# EAGLE design gatedelay 11-30-19 (EAGLE 9.5.1)
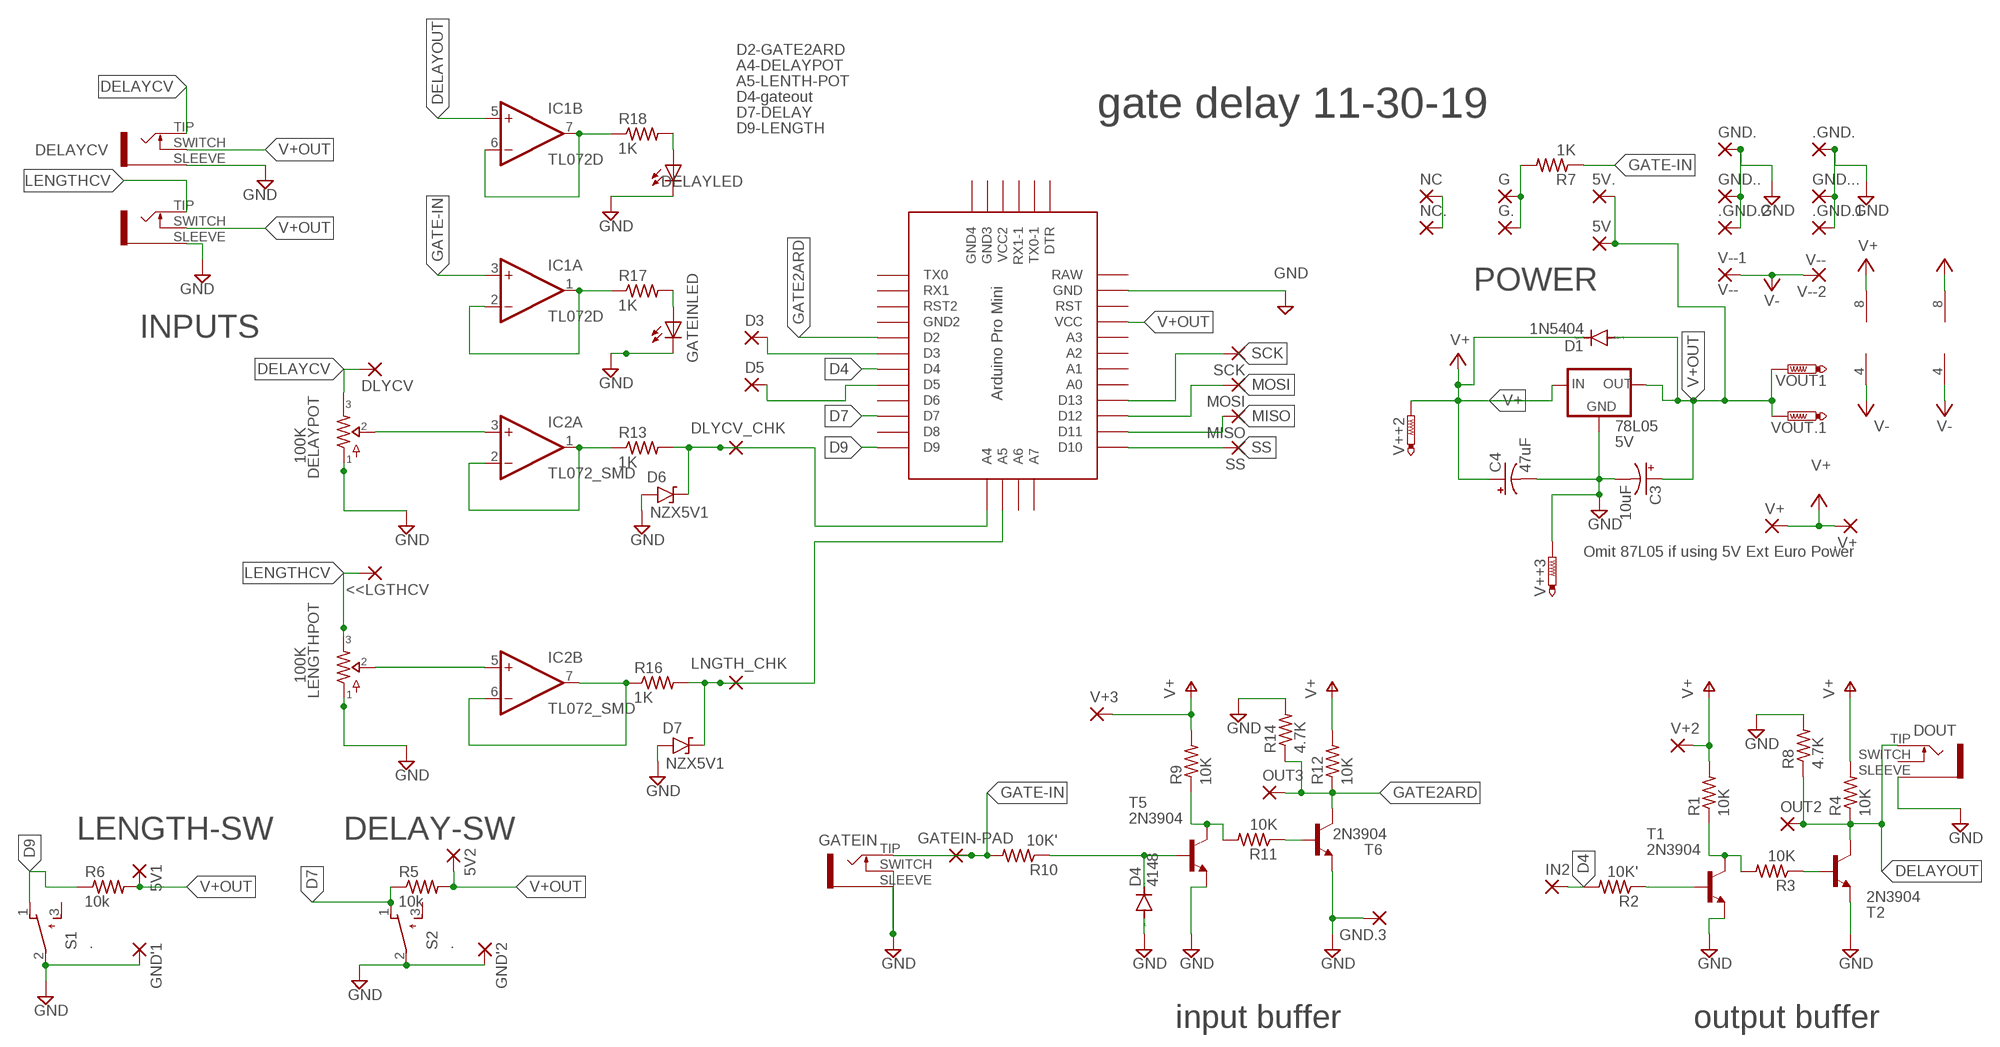
[diagram p0: schematic, sheet 1]

## Parts
5V  1,6/0,8  [1,6/0,8]
5V1  WIREPAD2,54/0,9  [2,54/0,9]
5V2  WIREPAD2,54/0,9  [2,54/0,9]
5V.  1,6/0,8  [1,6/0,8]
78L05  5V  78LXX  [78LXX]
.GND.  1,6/0,8  [1,6/0,8]
.GND.1  1,6/0,8  [1,6/0,8]
.GND.2  1,6/0,8  [1,6/0,8]
.V+  1,6/0,8  [1,6/0,8]
<<LGTHCV  3,17/1,3  [3,17/1,3]
C3  10uF  CPOL-USE2.5-6  [E2,5-6]
C4  47uF  CPOL-USE2.5-7  [E2,5-7]
D1  1N5404  1N4148DO35-10  [DO35-10]
D3  WIREPAD2,15/1,0  [2,15/1,0]
D4  4148  1N4148DO35-7  [DO35-7]
D5  WIREPAD2,15/1,0  [2,15/1,0]
D6  NZX5V1  ZENER.2  [DO41-2]
D7  NZX5V1  ZENER.2  [DO41-2]
DELAYCV  35RAPC2AV  [35RAPCVAV]
DELAYLED  LED3MM  [LED3MM]
DELAYPOT  100K  POTS9MM_VERT  [9MM_VERT]
DLYCV  WIREPAD1,6/0,9  [1,6/0,9]
DLYCV_CHK  3,17/1,3  [3,17/1,3]
DOUT  35RAPC2AV  [35RAPCVAV]
G  1,6/0,8  [1,6/0,8]
G.  1,6/0,8  [1,6/0,8]
GATEIN  35RAPC2AV  [35RAPCVAV]
GATEIN-PAD  WIREPAD1,6/0,9  [1,6/0,9]
GATEINLED  LED3MM  [LED3MM]
GND'1  WIREPAD2,54/0,9  [2,54/0,9]
GND'2  WIREPAD2,54/0,9  [2,54/0,9]
GND.  1,6/0,8  [1,6/0,8]
GND.3  WIREPAD1,6/0,9  [1,6/0,9]
GND..  1,6/0,8  [1,6/0,8]
GND...  1,6/0,8  [1,6/0,8]
IC1  TL072D  [SO08]
IC2  TL072_SMD  [SO08]
IN2  WIREPAD1,6/0,9  [1,6/0,9]
LENGTHCV  35RAPC2AV  [35RAPCVAV]
LENGTHPOT  100K  POTS9MM_VERT  [9MM_VERT]
LNGTH_CHK  3,17/1,3  [3,17/1,3]
MISO  WIREPAD1,6/0,9  [1,6/0,9]
MOSI  WIREPAD1,6/0,9  [1,6/0,9]
NC  1,6/0,8  [1,6/0,8]
NC.  1,6/0,8  [1,6/0,8]
OUT2  WIREPAD1,6/0,9  [1,6/0,9]
OUT3  WIREPAD1,6/0,9  [1,6/0,9]
R1  10K  R-US_0204/5  [0204/5]
R2  10K'  R-US_0204/5  [0204/5]
R3  10K  R-US_0204/5  [0204/5]
R4  10K  R-US_0204/5  [0204/5]
R5  10k  R-US_0207/10  [0207/10]
R6  10k  R-US_0204/5  [0204/5]
R7  1K  R-US_0207/7  [0207/7]
R8  4.7K  R-US_0204/5  [0204/5]
R9  10K  R-US_0204/5  [0204/5]
R10  10K'  R-US_0204/5  [0204/5]
R11  10K  R-US_0204/5  [0204/5]
R12  10K  R-US_0204/5  [0204/5]
R13  1K  R-US_0204/7  [0204/7]
R14  4.7K  R-US_0204/5  [0204/5]
R16  1K  R-US_0204/7  [0204/7]
R17  1K  R-US_0204/7  [0204/7]
R18  1K  R-US_0207/15  [0207/15]
S1  .  ALCOSWTT11  [ALCOSWTT11]
S2  .  ALCOSWTT11  [ALCOSWTT11]
SCK  WIREPAD1,6/0,9  [1,6/0,9]
SS  WIREPAD1,6/0,9  [1,6/0,9]
T1  2N3904  [TO92]
T2  2N3904  [TO92]
T5  2N3904  [TO92]
T6  2N3904  [TO92]
U$1  PRO-MINI  [PRO-MINI]
V+  1,6/0,8  [1,6/0,8]
V+2  WIREPAD1,6/0,9  [1,6/0,9]
V+3  WIREPAD1,6/0,9  [1,6/0,9]
V++2  PTR1PAD1-13Y  [P1-13Y]
V++3  PTR1PAD1-13Y  [P1-13Y]
V--1  V--  1,6/0,8  [1,6/0,8]
V--2  V--  1,6/0,8  [1,6/0,8]
VOUT1  PTR1PAD1-13Y  [P1-13Y]
VOUT.1  PTR1PAD1-13Y  [P1-13Y]

## Nets
D4: IN2.1(P) R2.2 U$1.D4
D7: R5.1 S2.1(O) U$1.D7
D9: R6.1 S1.1(O) U$1.D9
DELAYCV: DELAYCV.TIP DELAYPOT.3 DLYCV.1(P)
DELAYOUT: DOUT.TIP IC1.5(B:+IN) OUT2.1(P) R4.1 R8.1 T2.1(C)
GATE2ARD: OUT3.1(P) R12.1 R14.1 T6.1(C) U$1.D2
GATE-IN: GATEIN-PAD.1(P) GATEIN.TIP IC1.3(A:+IN) R7.1 R10.2
GND: 78L05.GND .GND.1.1(P) .GND.2.1(P) .GND..1(P) C3.- C4.- D4.A D6.A D7.A DELAYCV.SLEEVE DELAYLED.K(C) DELAYPOT.1 DOUT.SLEEVE GATEIN.SLEEVE GATEIN.SWITCH GATEINLED.K(C) GND'1.1(P) GND'2.1(P) GND.3.1(P) GND..1(P) GND...1(P) GND....1(P) LENGTHCV.SLEEVE LENGTHPOT.1 R8.2 R14.2 S1.2(P) S2.2(P) T1.3(E) T2.3(E) T5.3(E) T6.3(E) U$1.GND V++3.TP
LENGTHCV: <<LGTHCV.1(P) LENGTHCV.TIP LENGTHPOT.3
MISO: MISO.1(P) U$1.D11
MOSI: MOSI.1(P) U$1.D12
N$1: D5.1(P) U$1.D5
N$2: R2.1 T1.2(B)
N$3: R1.1 R3.2 T1.1(C)
N$4: R3.1 T2.2(B)
N$5: G.1(P) G..1(P) R7.2
N$6: D3.1(P) U$1.D3
N$7: NC.1(P) NC..1(P)
N$12: D4.C R10.1 T5.2(B)
N$13: R9.1 R11.2 T5.1(C)
N$14: R11.1 T6.2(B)
N$16: D6.C DLYCV_CHK.1(P) R13.2 U$1.A4
N$17: DELAYPOT.2 IC2.3(A:+IN)
N$18: IC2.1(A:OUT) IC2.2(A:-IN) R13.1
N$20: IC2.5(B:+IN) LENGTHPOT.2
N$21: IC2.6(B:-IN) IC2.7(B:OUT) R16.1
N$23: D7.C LNGTH_CHK.1(P) R16.2 U$1.A5
N$24: GATEINLED.A R17.2
N$26: IC1.1(A:OUT) IC1.2(A:-IN) R17.1
N$27: IC1.6(B:-IN) IC1.7(B:OUT) R18.1
N$29: DELAYLED.A R18.2
SCK: SCK.1(P) U$1.D13
SS: SS.1(P) U$1.D10
V+: 78L05.IN .V+.1(P) C4.+ D1.C IC1.8(P:V+) IC2.8(P:V+) R1.2 R4.2 R9.2 R12.2 V+2.1(P) V+3.1(P) V++2.TP V+.1(P)
V+OUT: 5V1.1(P) 5V2.1(P) 5V.1(P) 5V..1(P) 78L05.OUT C3.+ D1.A DELAYCV.SWITCH LENGTHCV.SWITCH R5.2 R6.2 U$1.VCC VOUT1.TP VOUT.1.TP
V-: IC1.4(P:V-) IC2.4(P:V-) V--1.1(P) V--2.1(P)
Unconnected: DOUT.SWITCH S1.3(S) S2.3(S) U$1.A0 U$1.A1 U$1.A2 U$1.A3 U$1.A6 U$1.A7 U$1.D6 U$1.D8 U$1.DTR U$1.GND1(GND2) U$1.GND2(GND4) U$1.GND3 U$1.RST U$1.RST1(RST2) U$1.RX1 U$1.RX1-1 U$1.TX0 U$1.TX0-1 U$1.VCC1(VCC2)

## Notes on the sheet
- D2-GATE2ARD
- A4-DELAYPOT
- A5-LENTH-POT
- D4-gateout
- D7-DELAY | gate delay 11-30-19
- D9-LENGTH
- POWER
- INPUTS
- Omit 87L05 if using 5V Ext Euro Power
- LENGTH-SW | DELAY-SW
- input buffer | output buffer

## Power pins joined to a net without a drawn wire
RAW: U$1.RAW

## Library data of the parts
5V 5V. .GND. .GND.1 .GND.2 .V+ G G. GND. GND.. GND... NC NC. V+ V--1 V--2 = wirepad-NONAMES:1,6/0,8: THROUGH-HOLE PAD
5V1 5V2 D3 D5 GND'1 GND'2 = wirepad:WIREPAD: Wire PAD connect wire on PCB
78L05 = v-reg:78LXX: VOLTAGE REGULATOR
<<LGTHCV DLYCV_CHK LNGTH_CHK = wirepad:3,17/1,3: THROUGH-HOLE PAD
C3 C4 = adafruit:CPOL-US: POLARIZED CAPACITOR, American symbol
D1 D4 = diode:1N4148: DIODE high speed (Philips)
D6 D7 = diodes:ZENER
DELAYCV DOUT GATEIN LENGTHCV = MusicThingModular-CL:35RAPC2AV: Switchcraft 35RAPC2AV jack
DELAYLED GATEINLED = adafruit:LED: LED OSRAM: - CHIPLED LG R971, LG N971, LY N971, LG Q971, LY Q971, LO R971, LY R971 LH N974, LH R974 LS Q976, LO Q976, LY Q976 LO Q996 - Hyper CHIPLED LW Q18S LB Q993, LB Q99A, LB R99A - SideLED LS A670, LO A670, LY A670, LG A670, LP A670 LB A673, LV A673, LT A673, LW A673 LH A674 LY A675 LS A676, LA A676, LO A676, LY A676, LW A676 LS A679, LY A679, LG A679 - Hyper Micro SIDELED® LS Y876, LA Y876, LO Y876, LY Y876 LT Y87S - SmartLED LW L88C, LW L88S LB L89C, LB L89S, LG L890 LS L89K, LO L89K, LY L89K LS L896, LA L896, LO L896, LY L896 - TOPLED LS T670, LO T670, LY T670, LG T670, LP T670 LSG T670, LSP T670, LSY T670, LOP T670, LYG T670 LG T671, LOG T671, LSG T671 LB T673, LV T673, LT T673, LW T673 LH T674 LS T676, LA T676, LO T676, LY T676, LB T676, LH T676, LSB T676, LW T676 LB T67C, LV T67C, LT T67C, LS T67K, LO T67K, LY T67K, LW E67C LS E67B, LA E67B, LO E67B, LY E67B, LB E67C, LV E67C, LT E67C LW T67C LS T679, LY T679, LG T679 LS T770, LO T770, LY T770, LG T770, LP T770 LB T773, LV T773, LT T773, LW T773 LH T774 LS E675, LA E675, LY E675, LS T675 LS T776, LA T776, LO T776, LY T776, LB T776 LHGB T686 LT T68C, LB T68C - Hyper Mini TOPLED® LB M676 - Mini TOPLED Santana® LG M470 LS M47K, LO M47K, LY M47K Source: http://www.osram.convergy.de/
DELAYPOT LENGTHPOT = potentiometers:POTS
DLYCV GATEIN-PAD GND.3 IN2 MISO MOSI OUT2 OUT3 SCK SS V+2 V+3 = wirepad-NONAMES:WIREPAD: Wire PAD connect wire on PCB
IC1 = linear:TL072: OP AMP
IC2 = MusicThingModular:TL072: Generic Dual Op Amp
R1-R4 R8-R12 R14 R18 = rcl:R-US_: RESISTOR, American symbol; SPICEPREFIX: R
R5-R7 R17 = adafruit:R-US_: RESISTOR, American symbol
R13 R16 = rcl:R-US_: RESISTOR, American symbol
S1 S2 = switch-CL:ALCOSWTT11: TINY SWITCH ON - MOM Source: http://www2.produktinfo.conrad.com/datenblaetter/700000-724999/705152-da-01-de-Subminiaturschalter_TL_36YO.pdf
T1 T2 T5 T6 = transistor:2N3904: NPN TRANSISTOR
U$1 = Arduino-clone:PRO-MINI: Arduion Pro Mini Clone V1.0 www.betemcu.cu
V++2 V++3 VOUT1 VOUT.1 = testpad-CL:PTR1: TEST PIN

## Board
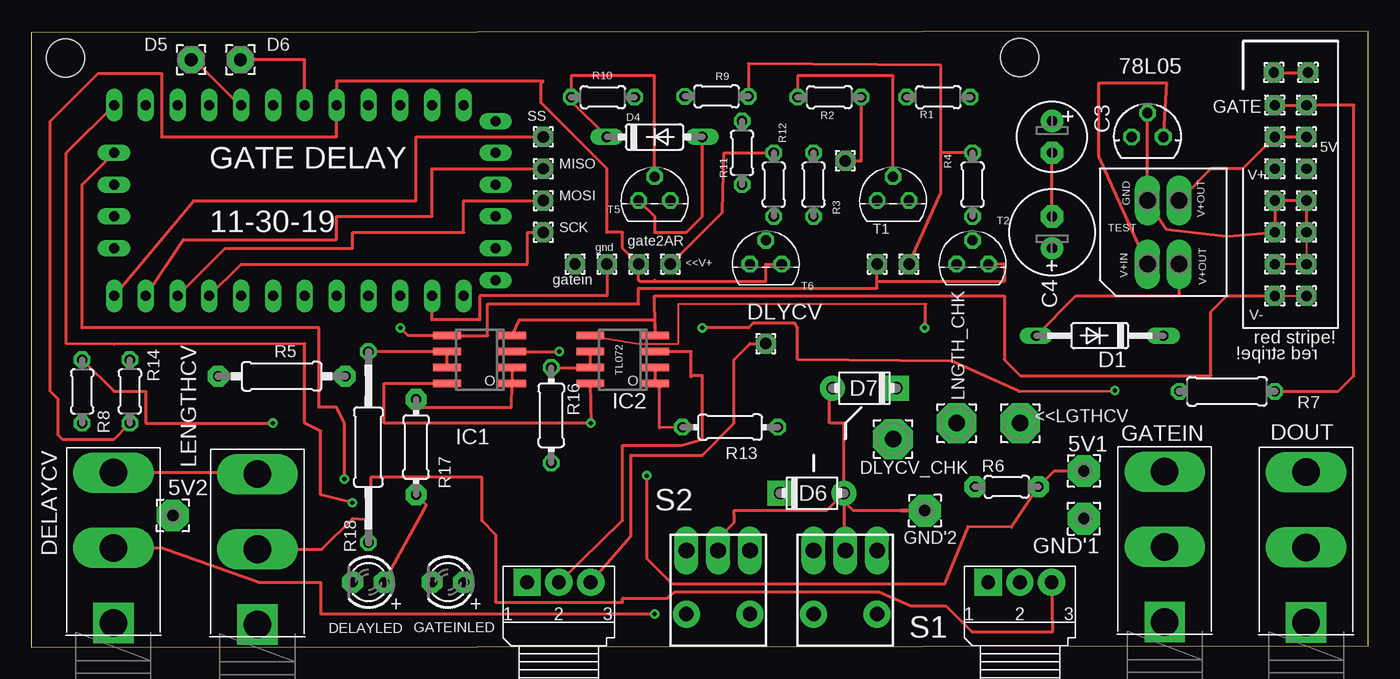
[diagram p1: board, top side]
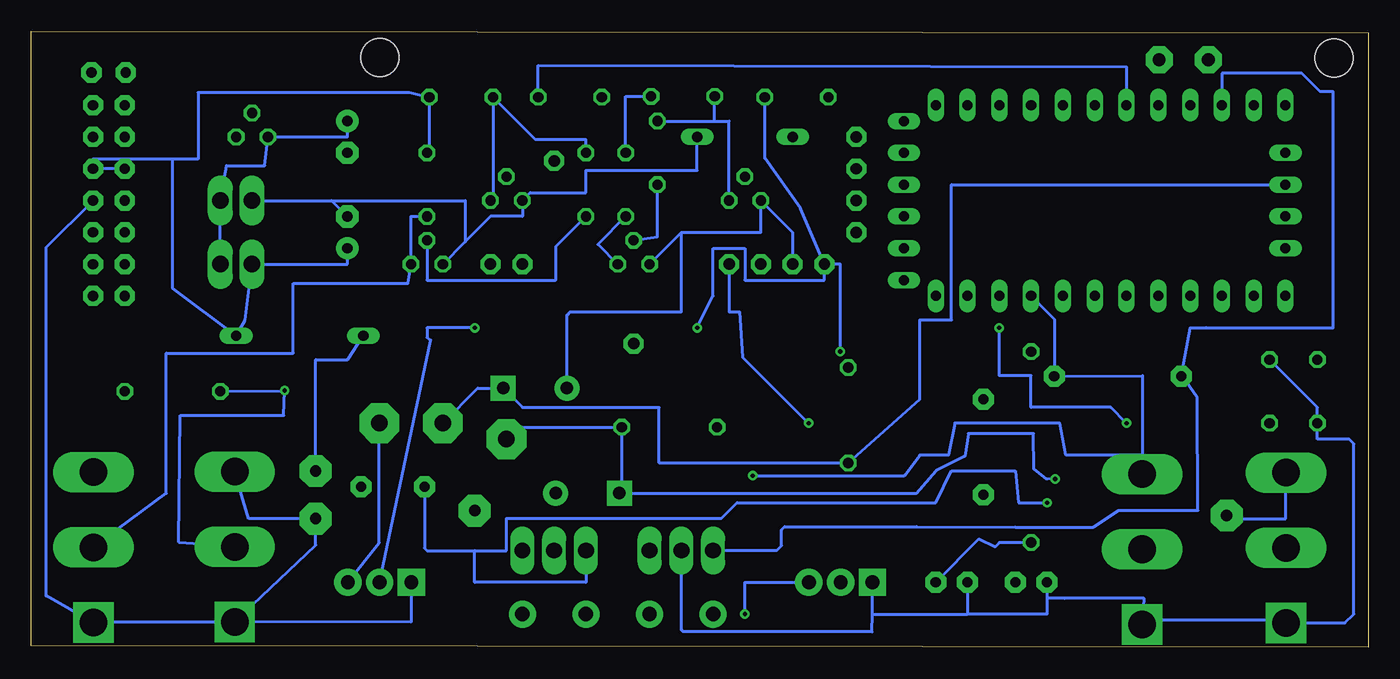
[diagram p2: board, bottom side, seen from below]

Size 106.79 x 49.2 mm. Coordinates in mm from the lower left corner, seen from the top.
Outline: 0,0 106.79,0.13 106.79,49.2 0,49.07 0,0
Copper layers (1*16): Top 0.035mm / dielectric 1.5mm / Bottom 0.035mm
Design rules "default": minimum track width 6mil, minimum drill 0.35mm, track to track 6mil, track to pad 6mil, pad to pad 6mil, via to via 6mil, smd to smd 6mil, copper to edge 40mil, drill to drill 6mil, minimum pad ring 10mil, minimum via ring 8mil, stop-mask expansion 4mil, vias tented up to drill 0mil, thermal gap 10mil
Holes 3.05 mm at 78.93,47.12 2.73,47.05

### Footprints (pad centres in the part's own frame; a part is rotated, then mirrored left to right if it is on the bottom)
1,6/0,8 = drill 0.813 pad 1.6 octagon: 1 0,0
2,54/0,9 = drill 0.914 pad 2.54 octagon: 1 0,0
78LXX = drill 0.813 octagon: GND 0,1.905; IN 1.27,0; OUT -1.27,0
3,17/1,3 = drill 1.321 pad 3.175 octagon: 1 0,0
E2,5-6 = drill 0.813 pad 1.778: + -1.27,0 | drill 0.813 pad 1.778 octagon: - 1.27,0
E2,5-7 = drill 0.813 pad 1.778: + -1.27,0 | drill 0.813 pad 1.778 octagon: - 1.27,0
DO35-10 = drill 0.813 long: A 5.08,0; C -5.08,0
2,15/1,0 = drill 1.016 pad 2.159 octagon: 1 0,0
DO35-7 = drill 0.813 long: A 3.81,0; C -3.81,0
DO41-2 = drill 1 pad 2: A 2.54,0 | drill 1 pad 2 square: C -2.54,0
35RAPCVAV = drill 2.2 pad 1.778 square: SLEEVE 0,-6 | drill 2.2 pad 2.184 long: SWITCH 0,6; TIP 0,0
LED3MM = drill 0.813 pad 1.676 octagon: A -1.27,0; K 1.27,0
9MM_VERT = drill 1.1 pad 2.184 square: 1 2.54,0 | drill 1.1 pad 2.184: 2 0,0; 3 -2.54,0
1,6/0,9 = drill 0.914 pad 1.6 octagon: 1 0,0
SO08 = smd 0.6 x 2.2: 1 -1.905,-2.6; 2 -0.635,-2.6; 3 0.635,-2.6; 4 1.905,-2.6; 5 1.905,2.6; 6 0.635,2.6; 7 -0.635,2.6; 8 -1.905,2.6
0204/5 = drill 0.813 octagon: 1 -2.54,0; 2 2.54,0
0207/10 = drill 0.813 pad 1.676 octagon: 1 -5.08,0; 2 5.08,0
0204/5' = drill 0.813 pad 1.676 octagon: 1 -2.54,0; 2 2.54,0
0207/7 = drill 0.813 octagon: 1 -3.81,0; 2 3.81,0
0204/7 = drill 0.813 octagon: 1 -3.81,0; 2 3.81,0
0204/7' = drill 0.813 pad 1.676 octagon: 1 -3.81,0; 2 3.81,0
0207/15 = drill 0.813 octagon: 1 -7.62,0; 2 7.62,0
ALCOSWTT11 = drill 1.27 pad 1.778 long: 1 -2.54,2.54; 2 0,2.54; 3 2.54,2.54 | drill 1.143 pad 2.159: 4 -2.54,-2.54; 5 2.54,-2.54
TO92 = drill 0.813 octagon: 1 1.27,0; 2 0,1.905; 3 -1.27,0
PRO-MINI = drill 0.8 long: A0 8.89,8.89; A1 8.89,11.43; A2 8.89,13.97; A3 8.89,16.51; A4 -2.54,-1.27; A5 0,-1.27; A6 2.54,-1.27; A7 5.08,-1.27; D2 -6.35,16.51; D3 -6.35,13.97; D4 -6.35,11.43; D5 -6.35,8.89; D6 -6.35,6.35; D7 -6.35,3.81; D8 -6.35,1.27; D9 -6.35,-1.27; D10 8.89,-1.27; D11 8.89,1.27; D12 8.89,3.81; D13 8.89,6.35; DTR 7.62,29.21; GND 8.89,24.13; GND1 -6.35,19.05; GND2 -5.08,29.21; GND3 -2.54,29.21; RAW 8.89,26.67; RST 8.89,21.59; RST1 -6.35,21.59; RX1 -6.35,24.13; RX1-1 2.54,29.21; TX0 -6.35,26.67; TX0-1 5.08,29.21; VCC 8.89,19.05; VCC1 0,29.21
P1-13Y = drill 1.321 pad 1.905 long: TP 0,0

### Placement (x,y rotation side)
5V  99.31,40.77 0 top
5V1  84.07,14.1 0 top
5V2  11.3,10.54 0 top
5V.  101.85,40.77 0 top
78L05  89.15,40.77 0 top
.GND.  101.85,35.69 0 top
.GND.1  101.85,30.61 0 top
.GND.2  99.31,30.61 0 top
.V+  99.31,38.23 0 top
<<LGTHCV  78.99,17.91 0 top
C3  81.53,40.77 270 top
C4  81.53,33.15 90 top
D1  85.34,24.89 180 top
D3  16.7,46.93 0 top
D4  49.78,40.77 0 top
D5  12.76,46.93 0 top
D6  62.36,12.32 0 top
D7  66.55,20.7 180 top
DELAYCV  6.55,7.96 0 top
DELAYLED  33.27,5.21 180 top
DELAYPOT  42.14,5.21 180 top
DLYCV  58.67,24.26 0 top
DLYCV_CHK  68.83,16.64 0 top
DOUT  101.83,7.99 0 top
G  101.85,43.31 0 top
G.  99.31,43.31 0 top
GATEIN  90.54,8.04 0 top
GATEIN-PAD  43.43,30.61 0 top
GATEINLED  26.92,5.21 180 top
GND'1  84.07,10.29 180 top
GND'2  71.37,10.92 0 top
GND.  99.31,35.69 0 top
GND.3  45.97,30.61 0 top
GND..  99.31,33.15 0 top
GND...  101.85,33.15 0 top
IC1  35.81,22.99 90 top
IC2  47.24,22.99 90 top
IN2  65.02,38.86 0 top
LENGTHCV  18.06,7.84 0 top
LENGTHPOT  78.97,5.21 180 top
LNGTH_CHK  73.91,17.91 0 top
MISO  40.89,38.23 0 top
MOSI  40.89,35.69 0 top
NC  101.98,45.91 0 top
NC.  99.25,45.91 0 top
OUT2  67.56,30.61 0 top
OUT3  48.51,30.61 0 top
R1  72.45,43.94 0 top
R2  63.75,43.94 0 top
R3  62.48,36.96 90 top
R4  75.18,36.96 90 top
R5  20,21.65 0 top
R6  10k  [0204/5']  77.91,12.83 0 top
R7  95.5,20.45 0 top
R8  4.06,20.45 270 top
R9  54.74,44.01 0 top
R10  45.66,43.94 0 top
R11  56.77,39.5 90 top
R12  59.31,36.96 90 top
R13  55.82,17.59 0 top
R14  7.87,20.45 90 top
R16  41.53,18.54 270 top
R17  1K  [0204/7']  30.73,16 270 top
R18  26.92,16 270 top
S1  65.02,5.21 0 top
S2  54.86,5.21 0 top
SCK  40.89,33.15 0 top
SS  40.89,40.77 0 top
T1  68.83,35.69 0 top
T2  75.18,30.61 0 top
T5  49.78,35.69 0 top
T6  58.67,30.61 0 top
U$1  7.87,36.96 270 top
V+  101.85,38.23 0 top
V+2  70.1,30.61 0 top
V+3  51.05,30.61 0 top
V++2  89.15,30.61 0 top
V++3  89.15,35.69 0 top
V--1  99.31,28.07 0 top
V--2  101.85,28.07 0 top
VOUT1  91.69,35.69 0 top
VOUT.1  91.69,30.61 0 top

### Tracks (layer width: path | path; a pad name or v marks a point on that pad's centre or on a via)
D4
  Top 0.254: IN2.1 66.29,38.86 R2.2
  Bottom 0.254: R2.2 66.29,46.48 19.3,46.36 U$1.D4
D7
  Bottom 0.254: S2.1 47.24,7.75 46.86,8.13 46.86,9.4 46.61,9.65 36.07,9.65 28.19,9.62 21.97,9.59 19.94,10.92 13.6,10.92 13.66,19.98 14.55,21.28 R5.1 14.22,25.53 12.95,25.53 2.79,25.53 2.79,44.39 3.83,44.39 5.3,45.85 11.68,45.85 U$1.D7
D9  (via drill 0.35)
  Top 0.254: v25.65,11.56 23.11,12.19 23.11,17.27 21.84,17.91 21.84,24.26 6.6,24.19 2.79,24.26 2.79,39.5 U$1.D9
  Bottom 0.254: R6.1 75.38,7.94 75.18,7.74 71.37,7.74 | 71.37,7.74 68.83,7.74 68.83,10.29 51.69,10.29 50.42,11.56 34.54,11.56 33.27,14.1 28.19,14.1 27.94,11.56 v25.65,11.56 | S1.1 62.48,5.21 71.37,5.21 71.37,7.74
DELAYCV  (via drill 0.35)
  Top 0.254: DELAYPOT.3 47.88,8.87 47.88,15.37 53.59,15.37 56.13,17.91 56.13,22.99 57.4,24.26 DLYCV.1 | DELAYCV.TIP 10.34,7.96 18.12,5.21 23.11,5.21 23.11,2.67 25.65,2.67 v49.78,2.67
  Bottom 0.254: v49.78,2.67 49.78,5.21 DELAYPOT.3
DELAYOUT  (via drill 0.35)
  Top 0.254: T2.1 77.72,30.61 77.72,29.21 67.56,29.21 | 67.56,29.21 67.56,28.7 48.51,28.7 48.51,27.43 36.45,27.43 36.45,24.89 IC1.5 30.1,24.89 v29.46,25.53 | 67.56,29.21 OUT2.1 | R8.1 6.6,20.45 9.14,20.45 9.14,17.91 v19.3,17.91
  Bottom 0.254: R4.1 76.45,34.42 T2.1 76.71,29.08 85.85,29.08 85.85,23.49 96.01,23.49 96.01,12.31 DOUT.TIP | v19.3,17.91 20.57,19.18 26.92,19.18 26.92,21.72 29.46,21.72 v29.46,25.53
GATE2ARD
  Top 0.254: 49.78,29.21 49.78,29.34 | 49.78,29.21 58.67,29.21 58.67,30.61 T6.1 | R14.1 6.6,16.64 2.48,16.64 2.16,16.95 2.16,19.81 1.52,20.45 1.52,42.04 5.33,45.85 10.41,45.85 10.41,40.77 24.38,40.77 U$1.D2 24.38,45.21 40.89,45.21 40.7,45.02 40.7,43.5 45.97,38.23 45.97,33.15 47.24,33.15 47.24,31.88 OUT3.1 48.51,29.34 48.64,29.21 49.78,29.21
  Bottom 0.254: R12.1 61.53,32.2 T6.1
GATE-IN  (via drill 0.35)
  Top 0.254: IC1.3 v42.16,23.62 | v53.59,25.53 57.3,25.53 57.65,25.87 61.01,25.87 61.21,25.53 61.21,22.99 73.53,22.86 78.87,20.45 78.99,20.45 v86.55,20.51
  Bottom 0.254: GATEIN-PAD.1 45.34,35.05 48.2,39.05 R10.2 | v42.16,23.62 42.16,30.61 GATEIN-PAD.1 | GATEIN-PAD.1 43.43,29.34 49.78,29.34 49.78,31.88 52.32,31.88 52.32,28.07 v53.59,25.53 | GATEIN.TIP 91.52,8.18 95,8.42 94.88,18.54 86.61,18.54 v86.55,20.51 R7.1
GND
  Top 0.152: GND....1 .GND.1.1 .GND.2.1
  Top 0.254: T5.3 49.78,34.42 49.78,33.15 52.32,33.15 53.59,34.42 D4.A | 78L05.GND V++3.TP 90.68,33.4 95.52,32.83 GND...1 GND..1 .GND..1 GND....1 | GND.3.1 45.97,28.07 35.81,28.07 35.81,26.16 32,26.16 U$1.GND | 64.58,12 63.5,10.92 56.13,10.92 56.13,10.58 56.16,10.56 56.16,10.02 54.86,8.72 S2.2 | 64.58,12 D6.A | 69.47,10.92 65.66,10.92 64.58,12 | D6.A 64.9,7.87 S1.2 | D6.A 64.9,17.91 63.75,17.91 63.75,20.45 D7.A | C4.- C3.-
  Top 0.305: GND'2.1 69.47,10.92
  Bottom 0.254: T2.3 72.14,32.39 | 72.14,32.39 70.1,34.42 67.56,34.42 T1.3 66.93,36.32 62.48,36.32 62.48,38.1 53.59,38.1 D4.A | T6.3 54.86,33.15 | 54.86,33.15 48.51,33.15 T5.3 45.97,33.15 GND.3.1 | V++3.TP 82.8,35.67 | 82.8,35.67 80.74,35.67 72.14,35.69 72.14,32.39 | GATEIN.SLEEVE 101.78,2.04 DOUT.SLEEVE 105.6,4.12 105.6,31.94 .GND..1 | 39.62,2.66 39.62,1.25 54.74,1.27 54.86,1.4 S2.2 | 39.62,2.66 DELAYPOT.1 | 39.62,2.66 32,2.67 | 32,2.67 25.65,2.67 25.65,3.94 | GATEIN.SLEEVE 84.07,8.17 GND'1.1 89.41,10.29 GATEIN.SWITCH | GATEIN.SLEEVE 76.45,2.03 76.45,5.19 LENGTHPOT.1 | 63.88,20.83 D7.A 64.01,26.54 63.75,26.8 54.86,26.8 54.86,33.15 | C4.- 82.8,35.67 | R14.2 4.06,19.18 R8.2 4.06,16.64 1.52,16.64 1.14,16.26 1.14,2.67 1.85,1.96 DELAYCV.SLEEVE 6.8,2.21 17.68,2.22 LENGTHCV.SLEEVE 17.93,3.94 24.25,3.93 25.64,3.93 25.65,3.94 | DELAYLED.K 32,2.67 | GATEINLED.K 25.65,3.94
LENGTHCV
  Top 0.254: LENGTHCV.TIP 23.21,7.84 25.65,10.29 27.11,10.16 27.11,13.59 36,13.59 35.99,10.11 37.08,9.02 37.08,3.62 47.24,3.62 47.24,3.94 50.8,3.94 51.44,4.44 67.69,4.44 70.28,3.33 73.05,3.33 75.14,1.24 81.6,1.24 81.53,5.21 LENGTHPOT.3
  Bottom 0.254: LENGTHPOT.3 78.99,8.38 <<LGTHCV.1
MISO
  Top 0.254: U$1.D11 12.15,32.58 24.38,32.58 24.38,34.42 32,34.42 32,38.23 MISO.1
MOSI
  Top 0.254: U$1.D12 15.49,31.88 25.65,31.88 25.65,33.15 34.54,33.15 34.54,35.69 MOSI.1
N$1
  Top 0.254: U$1.D5 16.64,43.31 13.56,46.38 13.2,46.93 D5.1
N$2
  Top 0.254: T1.2 68.83,45.64 61.21,45.64 R2.1
N$3
  Bottom 0.254: R3.2 62.48,40.56 66.54,40.56 R1.1 69.91,35.88 T1.1
N$4
  Bottom 0.254: T2.2 75.18,29.34 64.9,29.34 64.9,32 R3.1
N$5
  Top 0.254: G..1 G.1 105.64,43.31 105.64,21.7 104.39,20.45 R7.2
N$6
  Top 0.254: U$1.D3 21.84,46.93 D3.1
N$7
  Top 0.254: NC..1 NC.1
N$12
  Top 0.254: D4.C 43.12,43.62 R10.1 43.12,45.64 49.78,45.64 T5.2
N$13
  Bottom 0.254: T5.1 51.05,42.04 52.2,42.04 | 52.2,42.04 R9.1 | R11.2 52.2,42.04
N$14
  Bottom 0.254: T6.2 56.77,32.78 R11.1
N$16  (via drill 0.35)
  Top 0.254: U$1.A4 4.06,36.96 4.06,25.53 22.99,25.53 22.99,19.18 24.38,19.18 25.02,17.91 v25.02,13.46
  Bottom 0.254: v25.02,13.46 25.66,13.45 26.72,14.25 26.73,17.08 31.94,17.08 32.23,15.25 34.54,14.1 36.07,12.32 D6.C 59.63,12.51 R13.2 67.88,17.59 DLYCV_CHK.1
N$17
  Top 0.254: DELAYPOT.2 47.24,10.14 47.24,16.13 51.94,16.13 53.59,16.64 53.59,21.72 52.7,21.72 | 52.7,21.59 52.7,21.72 | 52.7,21.72 52.7,23.62 IC2.3
N$18
  Top 0.254: IC2.2 IC2.1 50.2,20.73 50.16,17.53 R13.1
N$20  (via drill 0.35)
  Top 0.152: IC2.5 48.51,24.26 51.69,24.26 51.69,27.43 71.37,27.43 71.5,27.43
  Top 0.254: 71.37,27.43 v71.37,25.53
  Bottom 0.254: LENGTHPOT.2 74.89,24.48 | 74.89,24.48 74.87,24.55 | v71.37,25.53 75.18,25.53 75.18,24.77 74.89,24.48
N$21
  Top 0.254: IC2.6 IC2.7 R16.1
N$23
  Bottom 0.254: LNGTH_CHK.1 71.12,20.7 D7.C 67.56,19.18 56.64,19.18 56.64,14.73 R16.2 35.81,19.81 35.81,26.16 33.27,26.16 33.27,36.96 U$1.A5
N$24
  Top 0.254: GATEINLED.A 31.57,11.36 R17.2
N$26
  Top 0.254: IC1.2 IC1.1 38.35,19.18 30.73,19.18 R17.1
N$27
  Top 0.254: IC1.7 IC1.6 R18.1
N$29
  Bottom 0.254: DELAYLED.A 31.08,8.67 29.79,8.06 29.46,8.38 R18.2
SCK
  Top 0.254: U$1.D13 16.76,30.61 39.62,30.61 39.62,33.15 SCK.1
SS
  Top 0.254: U$1.D10 12.95,35.69 30.73,35.69 30.73,40.77 SS.1
V+  (via drill 0.35)
  Top 0.254: V+3.1 55.19,34.75 55.19,34.81 55.33,39.5 R12.2 | V+2.1 72.64,36.32 72.64,39.5 | 72.64,39.5 72.64,46.49 57.28,46.61 R9.2 | IC2.8 v44.7,17.91 28.19,17.91 28.19,21.08 IC1.8 | V++2.TP 85.28,39.22 85.28,45.09 90.68,45.09 90.42,41.02 78L05.IN | R4.2 72.64,39.5
  Bottom 0.254: R4.2 74.99,39.69 R1.2 76.61,44.32 93.47,44.32 93.47,38.99 95.5,38.99 | 95.5,38.99 101.85,38.99 V+.1 .V+.1 | R12.2 59.31,44.01 R9.2 | V+3.1 51.05,26.8 50.21,26.8 49.97,23.17 v44.7,17.91 | C4.+ 81.53,30.61 V++2.TP 89.71,26.14 D1.C 95.5,28.7 95.5,38.99
V+OUT  (via drill 0.35)
  Top 0.254: 5V1.1 81.72,14.1 R6.2 78.29,9.59 74.8,9.65 72.95,5.08 51.18,5.08 49.15,7.11 v49.15,13.72 | LENGTHCV.SWITCH 17.93,13.97 DELAYCV.SWITCH | D1.A 83.44,28.07 91.69,28.07 VOUT.1.TP | VOUT1.TP 94.23,38.23 96.77,38.23 5V.1 5V..1
  Bottom 0.254: VOUT.1.TP VOUT1.TP 91.19,38.48 88.14,38.48 78L05.OUT 81.53,40.77 C3.+ | 5V1.1 84.07,22.99 81.53,22.99 D1.A | U$1.VCC 25.08,26.23 R5.2 18.03,21.72 18.05,14.1 | DELAYCV.SWITCH 6.6,13.96 | 6.6,13.96 8.9,13.91 | v49.15,13.72 37.08,13.72 37.06,13.72 35.81,15.37 33.53,15.37 33.02,17.91 24.64,17.91 24.13,15.37 18.03,15.37 18.05,14.1 | 18.05,14.1 LENGTHCV.SWITCH | 5V2.1 11.05,10.29 6.6,10.29 6.6,13.96
V-
  Top 0.152: V--1.1 V--2.1
  Top 0.254: IC1.4 38.99,26.16 49.78,26.16 49.81,25.53 | 49.81,25.53 IC2.4 | 49.81,25.53 49.78,28.07 77.72,28.07 77.72,22.99 78.99,21.72 94.23,21.72 94.23,26.8 95.5,28.07 V--1.1

### Text on the board
tNames: D5 | D6 | GATE | SS | 5V | GATE DELAY | MISO | V+ | MOSI | GND | V+OUT | 11-30-19 | SCK | TEST | gnd | gate2AR | gatein | <<V+ | V+IN | V+OUT | V- | red stripe! | red stripe! | TL072 | O | O